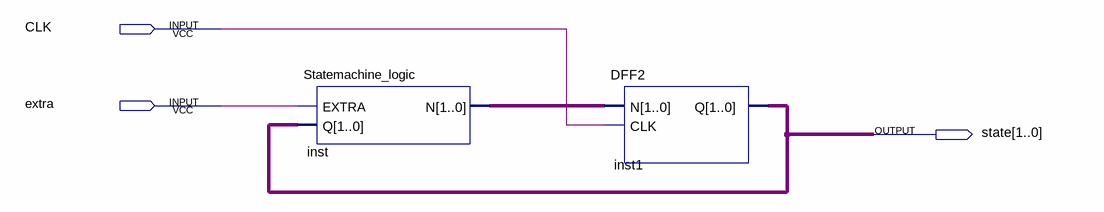
[diagram p0: schematic sheet]
// Quartus schematic statemachine.bdf as structural Verilog: 2 symbols, 3 pins
module statemachine (
  input  CLK,
  input  extra,
  output [1:0] state
);

  wire [1:0] inst_n;

  Statemachine_logic inst (.EXTRA(extra), .Q(state), .N(inst_n));
  DFF2 inst1 (.N(inst_n), .CLK(CLK), .Q(state));
endmodule
